# Altium schematic sheet Lm234.SchDoc: Test
size A4; DrawnBy: Łukasz Przeniosło; Organization: PRZENIOSLO; Address1: Electronics; Address2: &; Address3: Software; DocumentNumber: 2; Revision: 1.0; SheetNumber: 2; SheetTotal: 2
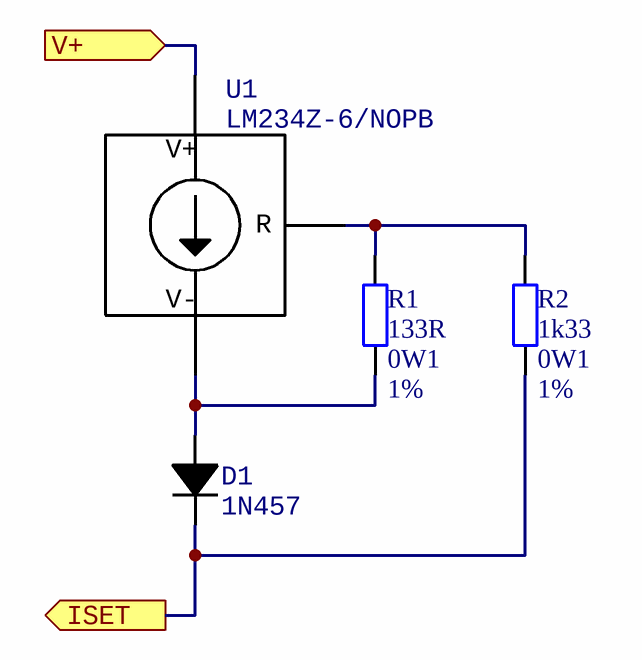
[diagram p0: Lm234.SchDoc]

## Parts
D1  1N457  [DO-35]
R1  133R  Power: 0W1  Tolerance: 1%  [RESC1608N]
R2  1k33  Power: 0W1  Tolerance: 1%  [RESC1608N]
U1  LM234Z-6/NOPB  [TO92]

## Ports
ISET (out), V+ (in)

## Nets
ISET: D1.1(K) R2.1 ; port ISET
V+: U1.3(V+) ; port V+
NetD1_2: D1.2(A) R1.1 U1.1(V-)
NetR1_2: R1.2 R2.2 U1.2(ADJ)

## Notes on the sheet
- Title:
- Date:
- Drawn by:
- Project:
- Time:
- Number:
- Sheet
- of
- File:
- (in symbol LM234Z-6/NOPB) R

## Library data of the parts
D1 = 1N400X: Universal diode; manid: 1N457
R1 R2 = Resistor
  R1: Value: 133R
  R2: Value: 1k33
U1 = LM234Z-6/NOPB: Three terminal adjustable current sources; manid: LM234Z-6/NOPB